# Altium schematic sheet 4_20mA_Conv.SchDoc
size A3; SheetNumber: 7; SheetTotal: 15
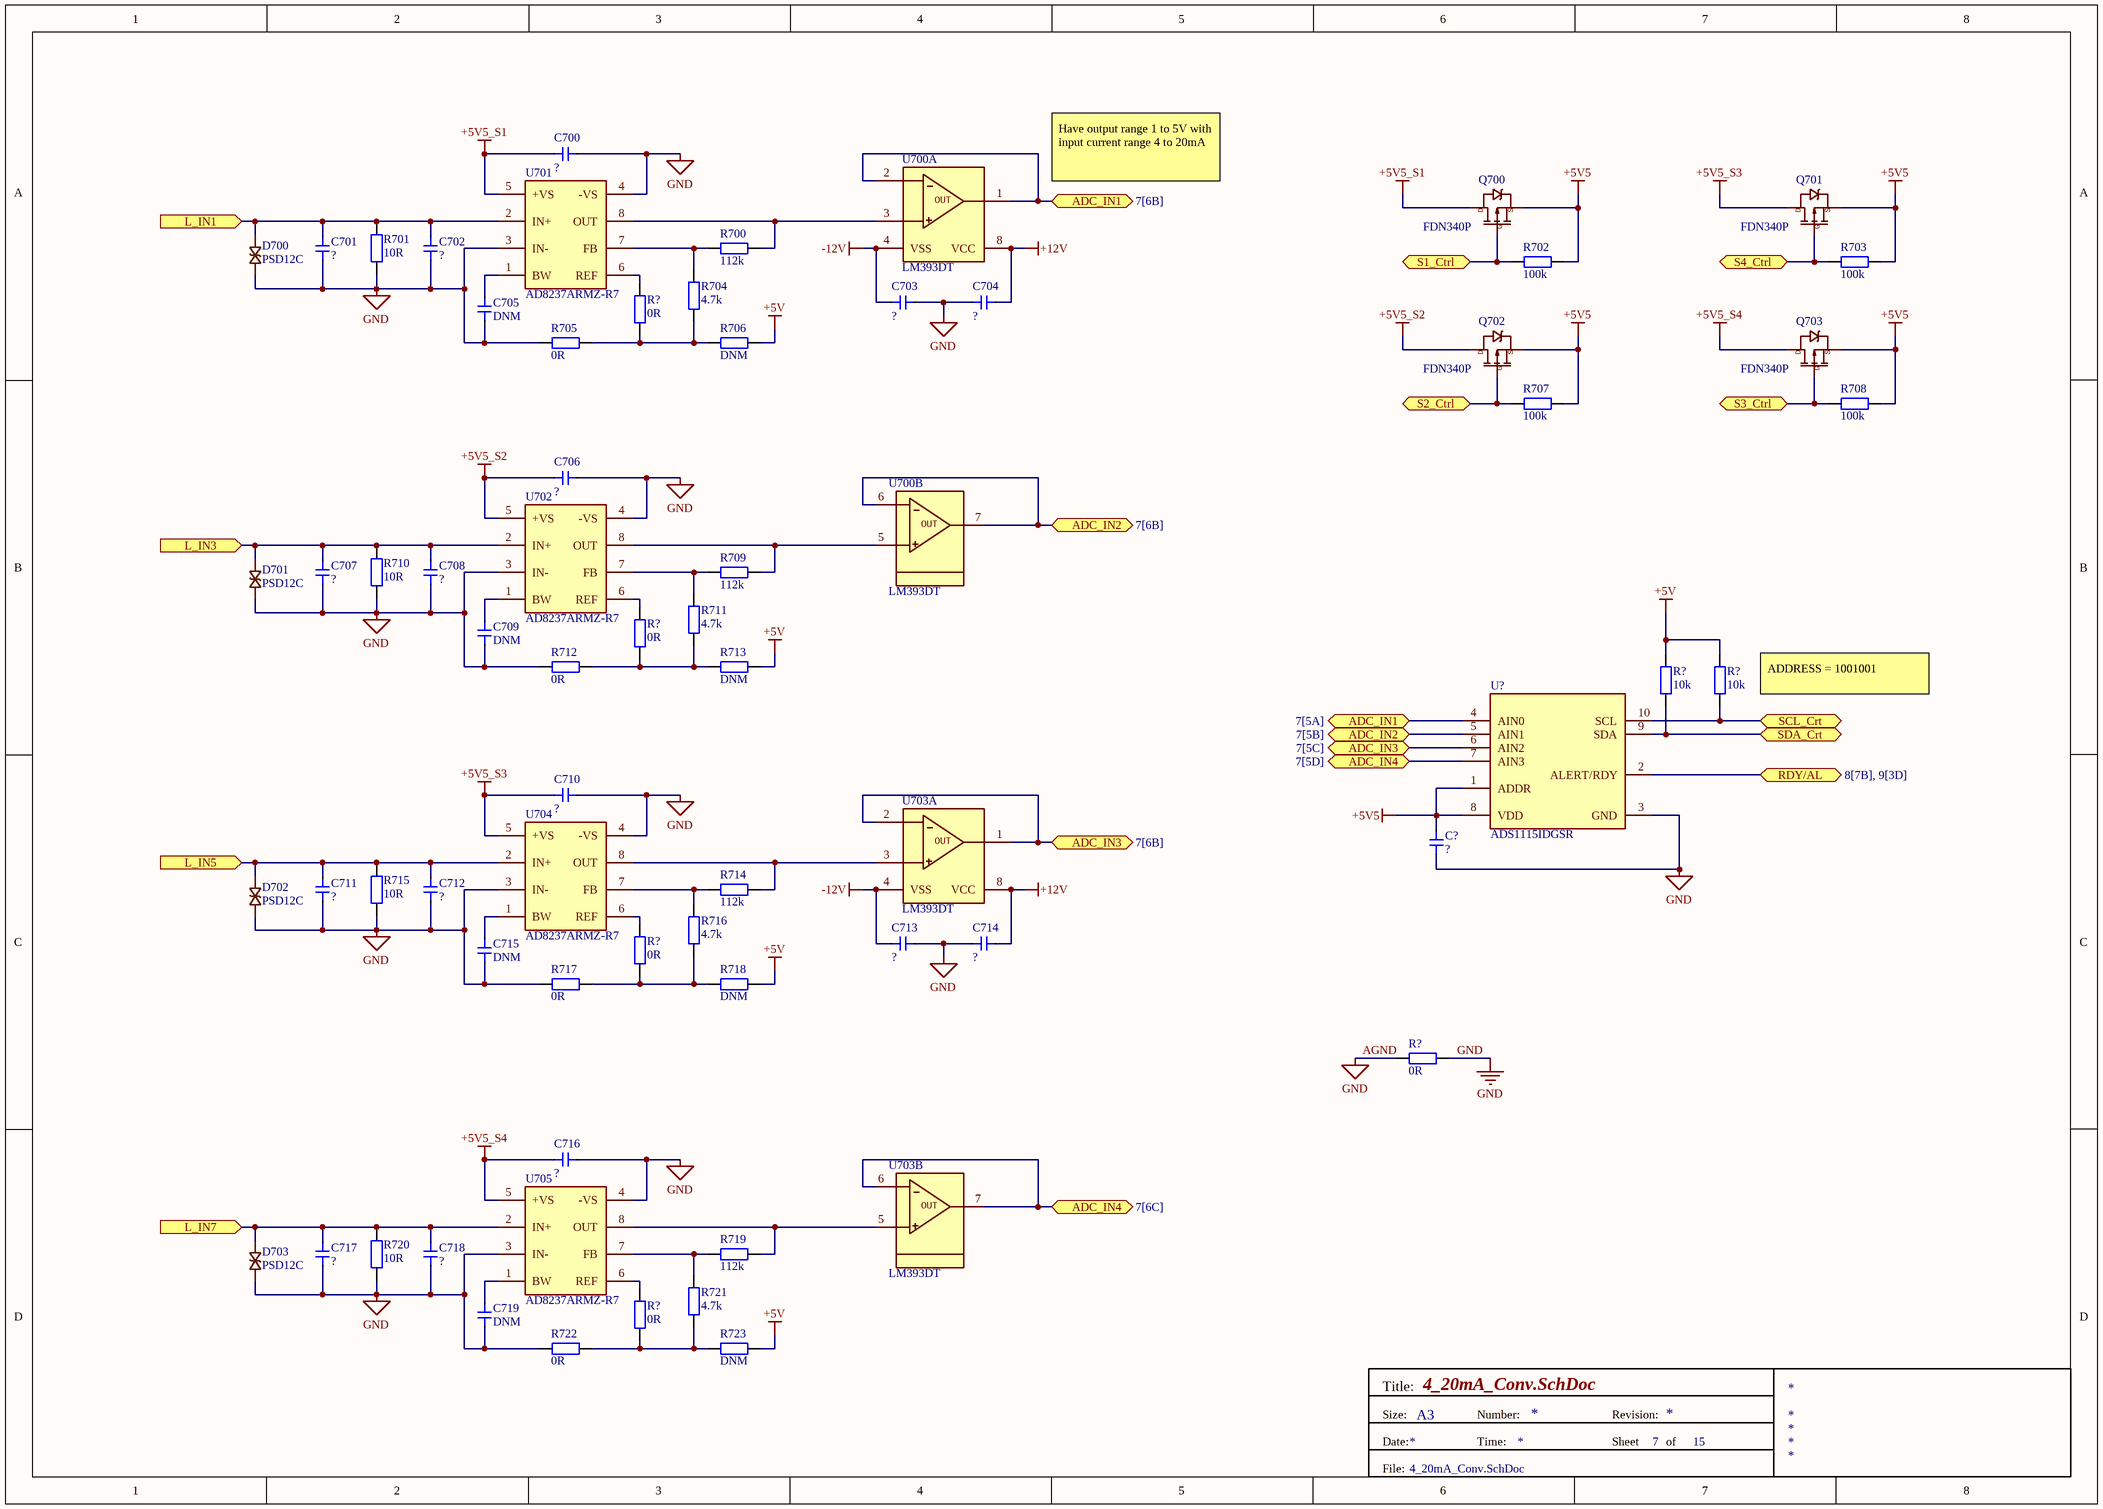
[diagram p0: 4_20mA_Conv.SchDoc]

## Parts
(Parts that share a designator on the sheet are numbered #1, #2 ... from top to bottom, then left to right.)
C700  ?  [Cap 0603]
C701  ?  [Cap 0603]
C702  ?  [Cap 0603]
C703  ?  [Cap 0603]
C704  ?  [Cap 0603]
C705  DNM  [Cap 0603]
C706  ?  [Cap 0603]
C707  ?  [Cap 0603]
C708  ?  [Cap 0603]
C709  DNM  [Cap 0603]
C710  ?  [Cap 0603]
C711  ?  [Cap 0603]
C712  ?  [Cap 0603]
C713  ?  [Cap 0603]
C714  ?  [Cap 0603]
C715  DNM  [Cap 0603]
C716  ?  [Cap 0603]
C717  ?  [Cap 0603]
C718  ?  [Cap 0603]
C719  DNM  [Cap 0603]
C?  ?  [Cap 0603]
D700  PSD12C  [SOD-323]
D701  PSD12C  [SOD-323]
D702  PSD12C  [SOD-323]
D703  PSD12C  [SOD-323]
Q700  FDN340P  [FDN340P]
Q701  FDN340P  [FDN340P]
Q702  FDN340P  [FDN340P]
Q703  FDN340P  [FDN340P]
R700  112k  [Tro smd 0603]
R701  10R  [tro smd 0603]
R702  100k  [tro smd 0603]
R703  100k  [tro smd 0603]
R704  4.7k  [tro smd 0603]
R705  0R  [tro smd 0603]
R706  DNM  [tro smd 0603]
R707  100k  [tro smd 0603]
R708  100k  [tro smd 0603]
R709  112k  [Tro smd 0603]
R710  10R  [tro smd 0603]
R711  4.7k  [tro smd 0603]
R712  0R  [tro smd 0603]
R713  DNM  [tro smd 0603]
R714  112k  [Tro smd 0603]
R715  10R  [tro smd 0603]
R716  4.7k  [tro smd 0603]
R717  0R  [tro smd 0603]
R718  DNM  [tro smd 0603]
R719  112k  [Tro smd 0603]
R720  10R  [tro smd 0603]
R721  4.7k  [tro smd 0603]
R722  0R  [tro smd 0603]
R723  DNM  [tro smd 0603]
R?#1  0R  [tro smd 0603]
R?#2  0R  [tro smd 0603]
R?#3  10k  [tro smd 0603]
R?#4  10k  [tro smd 0603]
R?#5  0R  [tro smd 0603]
R?#6  0R  [tro smd 0603]
R?#7  0R  [tro smd 0603]
U700  LM393DT  [SOIC8]  (parts A,B of 2)
U701  AD8237ARMZ-R7  [AD8237ARMZ-R7]
U702  AD8237ARMZ-R7  [AD8237ARMZ-R7]
U703  LM393DT  [SOIC8]  (parts A,B of 2)
U704  AD8237ARMZ-R7  [AD8237ARMZ-R7]
U705  AD8237ARMZ-R7  [AD8237ARMZ-R7]
U?  ADS1115IDGSR  [AD8237ARMZ-R7]

## Ports
ADC_IN1 (bidir, see 7[5A]), ADC_IN1 (bidir, see 7[6B]), ADC_IN2 (bidir, see 7[5B]), ADC_IN2 (bidir, see 7[6B]), ADC_IN3 (bidir, see 7[5C]), ADC_IN3 (bidir, see 7[6B]), ADC_IN4 (bidir, see 7[5D]), ADC_IN4 (bidir, see 7[6C]), L_IN1 (in), L_IN3 (in), L_IN5 (in), L_IN7 (in), RDY/AL (bidir, see 8[7B], 9[3D]), S1_Ctrl (bidir), S2_Ctrl (bidir), S3_Ctrl (bidir), S4_Ctrl (bidir), SCL_Crt (bidir), SDA_Crt (bidir)

## Nets
+5V: R706.1 R713.1 R718.1 R723.1 R?#3.2 R?#4.2
+5V5: C?.2 Q700.2 Q701.2 Q702.2 Q703.2 R702.2 R703.2 R707.2 R708.2 U?.1(ADDR) U?.8(VDD)
+5V5_S1: C700.1 Q700.3 U701.5(+VS)
+5V5_S2: C706.1 Q702.3 U702.5(+VS)
+5V5_S3: C710.1 Q701.3 U704.5(+VS)
+5V5_S4: C716.1 Q703.3 U705.5(+VS)
+12V: C704.2 C714.2 U700.8(VCC) U703.8(VCC)
-12V: C703.1 C713.1 U700.4(VSS) U703.4(VSS)
AGND: C700.2 C701.2 C702.2 C703.2 C704.1 C705.2 C706.2 C707.2 C708.2 C709.2 C710.2 C711.2 C712.2 C713.2 C714.1 C715.2 C716.2 C717.2 C718.2 C719.2 C?.1 D700.A D701.A D702.A D703.A R701.1 R705.2 R710.1 R712.2 R715.1 R717.2 R720.1 R722.2 R?#6.1 R?#6.2 U701.3(IN-) U701.4(-VS) U702.3(IN-) U702.4(-VS) U704.3(IN-) U704.4(-VS) U705.3(IN-) U705.4(-VS) U?.3(GND)  [also labelled GND]
ADC_IN1: U700.1 U700.2 U?.4(AIN0) ; port ADC_IN1
ADC_IN2: U700.6 U700.7 U?.5(AIN1) ; port ADC_IN2
ADC_IN3: U703.1 U703.2 U?.6(AIN2) ; port ADC_IN3
ADC_IN4: U703.6 U703.7 U?.7(AIN3) ; port ADC_IN4
L_IN1: C701.1 C702.1 D700.C R701.2 U701.2(IN+) ; port L_IN1
L_IN3: C707.1 C708.1 D701.C R710.2 U702.2(IN+) ; port L_IN3
L_IN5: C711.1 C712.1 D702.C R715.2 U704.2(IN+) ; port L_IN5
L_IN7: C717.1 C718.1 D703.C R720.2 U705.2(IN+) ; port L_IN7
RDY/AL: U?.2(ALERT/RDY) ; port RDY/AL
S1_Ctrl: Q700.1 R702.1 ; port S1_Ctrl
S2_Ctrl: Q702.1 R707.1 ; port S2_Ctrl
S3_Ctrl: Q703.1 R708.1 ; port S3_Ctrl
S4_Ctrl: Q701.1 R703.1 ; port S4_Ctrl
SCL_Crt: R?#4.1 U?.10(SCL) ; port SCL_Crt
SDA_Crt: R?#3.1 U?.9(SDA) ; port SDA_Crt
NetC705_1: C705.1 U701.1(BW)
NetC709_1: C709.1 U702.1(BW)
NetC715_1: C715.1 U704.1(BW)
NetC719_1: C719.1 U705.1(BW)
NetR700_1: R700.1 R704.2 U701.7(FB)
NetR700_2: R700.2 U700.3 U701.8(OUT)
NetR704_1: R704.1 R705.1 R706.2 R?#1.2
NetR709_1: R709.1 R711.2 U702.7(FB)
NetR709_2: R709.2 U700.5 U702.8(OUT)
NetR711_1: R711.1 R712.1 R713.2 R?#2.2
NetR714_1: R714.1 R716.2 U704.7(FB)
NetR714_2: R714.2 U703.3 U704.8(OUT)
NetR716_1: R716.1 R717.1 R718.2 R?#5.2
NetR719_1: R719.1 R721.2 U705.7(FB)
NetR719_2: R719.2 U703.5 U705.8(OUT)
NetR721_1: R721.1 R722.1 R723.2 R?#7.2
NetR?#1_1: R?#1.1 U701.6(REF)
NetR?#2_1: R?#2.1 U702.6(REF)
NetR?#5_1: R?#5.1 U704.6(REF)
NetR?#7_1: R?#7.1 U705.6(REF)

## Notes on the sheet
- Have output range 1 to 5V with input current range 4 to 20mA
- (near R?#4) ADDRESS = 1001001
- Title:
- Size:
- Date:
- A3
- Number:
- Time:
- Revision:
- Sheet
- of
- File:
- (in symbol FDN340P) D; S; G
- (in symbol LM393DT, part A) OUT
- (in symbol LM393DT, part B) OUT

## Library data of the parts
C700-C719 C? = Cap 0603: Capacitor SMD 0603
D700-D703 = PSD12C: Package SOD323, Diode TVS, 50 pF, 29.5 V
R700 R709 R714 R719 = Tro 0603 1% 33k: Dán; Don_Vi: Con; So_Chan: 2; Ten_Linh_Kien: Trở 0603 1% 33k; Ma_Hang: MH006335; Chung_Loai: Dán; Kieu_Chan: *
R701 R710 R715 R720 = Tro 0603 1% 1R: Dán; Don_Vi: Con; So_Chan: 2; Ten_Linh_Kien: Trở 0603 1% 1R; Ma_Hang: MH007007; Chung_Loai: Dán; Kieu_Chan: *
R702 R703 R707 R708 = Tro 0603 5% 100k: Dán; So_Chan: 2; Ten_Linh_Kien: Trở 0603 5% 100k; Ma_Hang: MH006314; Don_Vi: Con; Chung_Loai: Dán; Kieu_Chan: *
R704 R711 R716 R721 = Tro 0603 5% 4.7k: Dán; Don_Vi: Con; So_Chan: 2; Ten_Linh_Kien: Trở 0603 5% 4.7k; Ma_Hang: MH006327; Chung_Loai: Dán; Kieu_Chan: *
R705 R706 R712 R713 R717 R718 R722 R723 R?#1 R?#2 R?#5-R?#7 = Tro 0603 1% 0R: Dán; Don_Vi: Con; So_Chan: 2; Ten_Linh_Kien: Trở 0603 1% 0R; Ma_Hang: MH005792; Chung_Loai: Dán; Kieu_Chan: *
R?#3 R?#4 = Tro 0603 1% 10k: Dán; Don_Vi: Con; So_Chan: 2; Ten_Linh_Kien: Trở 0603 1% 10k; Ma_Hang: MH006333; Chung_Loai: Dán; Kieu_Chan: *
U700 U703 = LM393DT: Điện áp: 2V ~ 36V, ± 1V ~ 18V, Số chân: 8
U701 U702 U704 U705 = AD8237ARMZ-R7: Instrumentation Amplifier, 1 Func, 75uV Offset-Max, 0.2MHz Band Width, CMOS, PDSO8; Manufacturer: Analog Devices; Package Body Material: Plastic; Channels: 1; Package Equivalence Code: TSSOP8,.19; Power Supplies: 5V; Max Supply Current: 150uA; Qualification Status: Not Qualified; Supplier: Digikey; Supplier Part Number: AD8237ARMZ-R7CT-ND; Manufacturer Part Number: AD8237ARMZ-R7; RoHS: Yes; Category: Amplifiers - Op Amps, Buffer, Instrumentation; Stock: 5371; Pricing: 1=4.34, 10=2.871, 25=2.4888, 100=2.06, 250=1.8516, 500=1.72446 (USD); Case/Package: TSSOP; Pins: 8; Package Shape: Rectangular; Terminal Finish: Tin; Min Operating Temperature: -40°C; Max Operating Temperature: 125°C; JESD-609 Code: e3; Amplifier Type: INSTRUMENTATION AMPLIFIER; JESD-30 Code: R-PDSO-G8; Moisture Sensitivity Level: 1; Package Style: SMALL OUTLINE, THIN PROFILE, SHRINK PITCHMeter; Nominal Supply Voltage: 5V; Surface Mount: Yes; Technology: CMOS; Terminal Form: Gull Wing; Terminal Position: DUAL; Terminal Pitch: 0.635mm; Temperature Grade: AUTOMOTIVE; Reach SVHC Compliant: Yes; RoHS Compliant: Yes; ComponentLink1URL: https://datasheet.ciiva.com:443/pdfs/VipMasterIC/IC/ANDI/ANDIS13412/ANDIS13412-1.pdf?src-supplier=IHS+Markit; ComponentLink1Description: https://datasheet.ciiva.com:443/pdfs/VipMasterIC/IC/ANDI/ANDIS13412/ANDIS13412-1.pdf?src-supplier=IHS+Markit; ComponentLink2URL: https://datasheet.ciiva.com/6626/ad8237-6626733.pdf?src-supplier=Digikey; ComponentLink2Description: https://datasheet.ciiva.com/6626/ad8237-6626733.pdf?src-supplier=Digikey; ComponentLink3URL: https://datasheet.ciiva.com/8582/ad8237-8582303.pdf?src-supplier=Avnet; ComponentLink3Description: https://datasheet.ciiva.com/8582/ad8237-8582303.pdf?src-supplier=Avnet
U? = ADS1115IDGSR: ADC, Delta-Sigma, 16-Bit, 1 Func, 4 Channel, Serial Access, PDSO10; Manufacturer: Texas Instruments; Package Body Material: Plastic; Max Input Voltage (AC): 4.096V; Min Input Voltage (AC): -4.096V; Conversion Time-Max: 1.162us; Linearity Error-Max (EL): 0.0015%; Number of Analog In Channels: 4; Number of Bits: 16; Channels: 1; Output Bit Code: 2''S COMPLEMENT BINARY; Package Equivalence Code: TSSOP10,.19,20; Power Supplies: 3.3V; Sample Rate (Hz): 860kHz; Qualification Status: Not Qualified; Supplier: Digikey; Supplier Part Number: 296-38849-1-ND; Manufacturer Part Number: ADS1115IDGSR; RoHS: Yes; Category: Analog to Digital Converters (ADCs); Stock: 3443; Pricing: 1=4.96, 10=3.644, 25=3.3144, 100=2.952, 250=2.77904, 500=2.67478, 1000=2.58892 (USD); Case/Package: TSSOP; Pins: 10; Package Shape: Square; Terminal Finish: Nickel; Min Operating Temperature: -40°C; Max Operating Temperature: 125°C; JESD-609 Code: e4; Output Format: Serial; Converter Type: DELTA-SIGMA; JESD-30 Code: S-PDSO-G10; Moisture Sensitivity Level: 2; Package Style: SMALL OUTLINE, THIN PROFILE, SHRINK PITCHMeter; Peak Reflow Temperature (Cel): 260°C; Nominal Supply Voltage: 3.3V; Surface Mount: Yes; Terminal Form: Gull Wing; Terminal Position: DUAL; Length: 3mm; Width: 3mm; Height - Seated (Max): 1.1mm; Terminal Pitch: 0.5mm; Temperature Grade: AUTOMOTIVE; Reach SVHC Compliant: Yes; RoHS Compliant: Yes; ComponentLink1URL: https://www.ti.com:443/lit/ds/symlink/ads1113.pdf?src-supplier=IHS+Markit; ComponentLink1Description: https://www.ti.com:443/lit/ds/symlink/ads1113.pdf?src-supplier=IHS+Markit; ComponentLink2URL: https://datasheet.ciiva.com/4031/47725463s8438921n7713-4031028.pdf?src-supplier=Arrow+Electronics; ComponentLink2Description: https://datasheet.ciiva.com/4031/47725463s8438921n7713-4031028.pdf?src-supplier=Arrow+Electronics